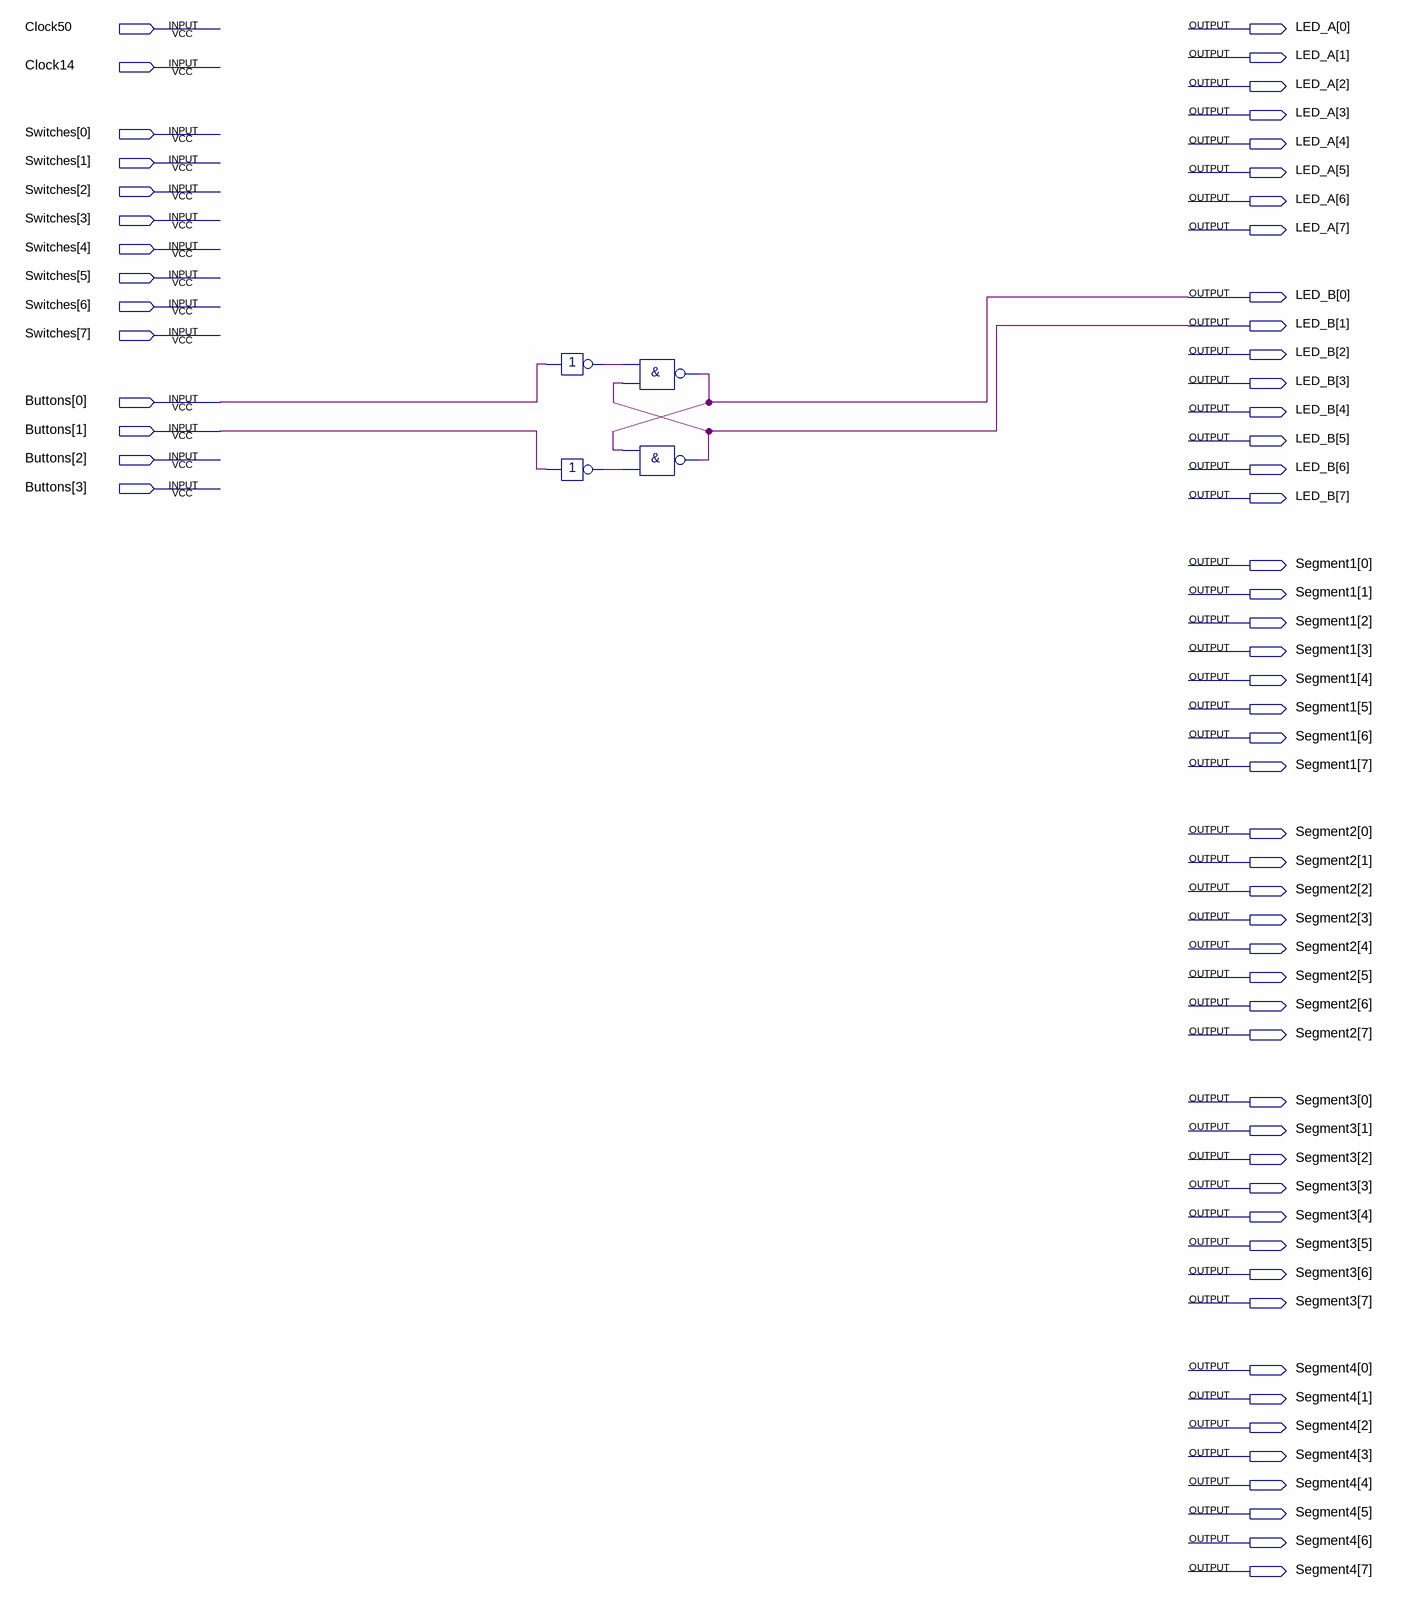
[diagram p0: schematic sheet]
// Quartus schematic RSFlipFlop.bdf as structural Verilog: 4 symbols, 62 pins
module RSFlipFlop (
  input  Clock50,
  input  Clock14,
  input  [7:0] Switches,
  input  [3:0] Buttons,
  output [7:0] LED_A,
  output [7:0] LED_B,
  output [7:0] Segment1,
  output [7:0] Segment2,
  output [7:0] Segment3,
  output [7:0] Segment4
);

  wire inst6_out, inst7_out;

  not inst6 (inst6_out, Buttons[0]);
  not inst7 (inst7_out, Buttons[1]);
  nand inst4 (LED_B[0], inst6_out, LED_B[1]);
  nand inst5 (LED_B[1], LED_B[0], inst7_out);
endmodule
